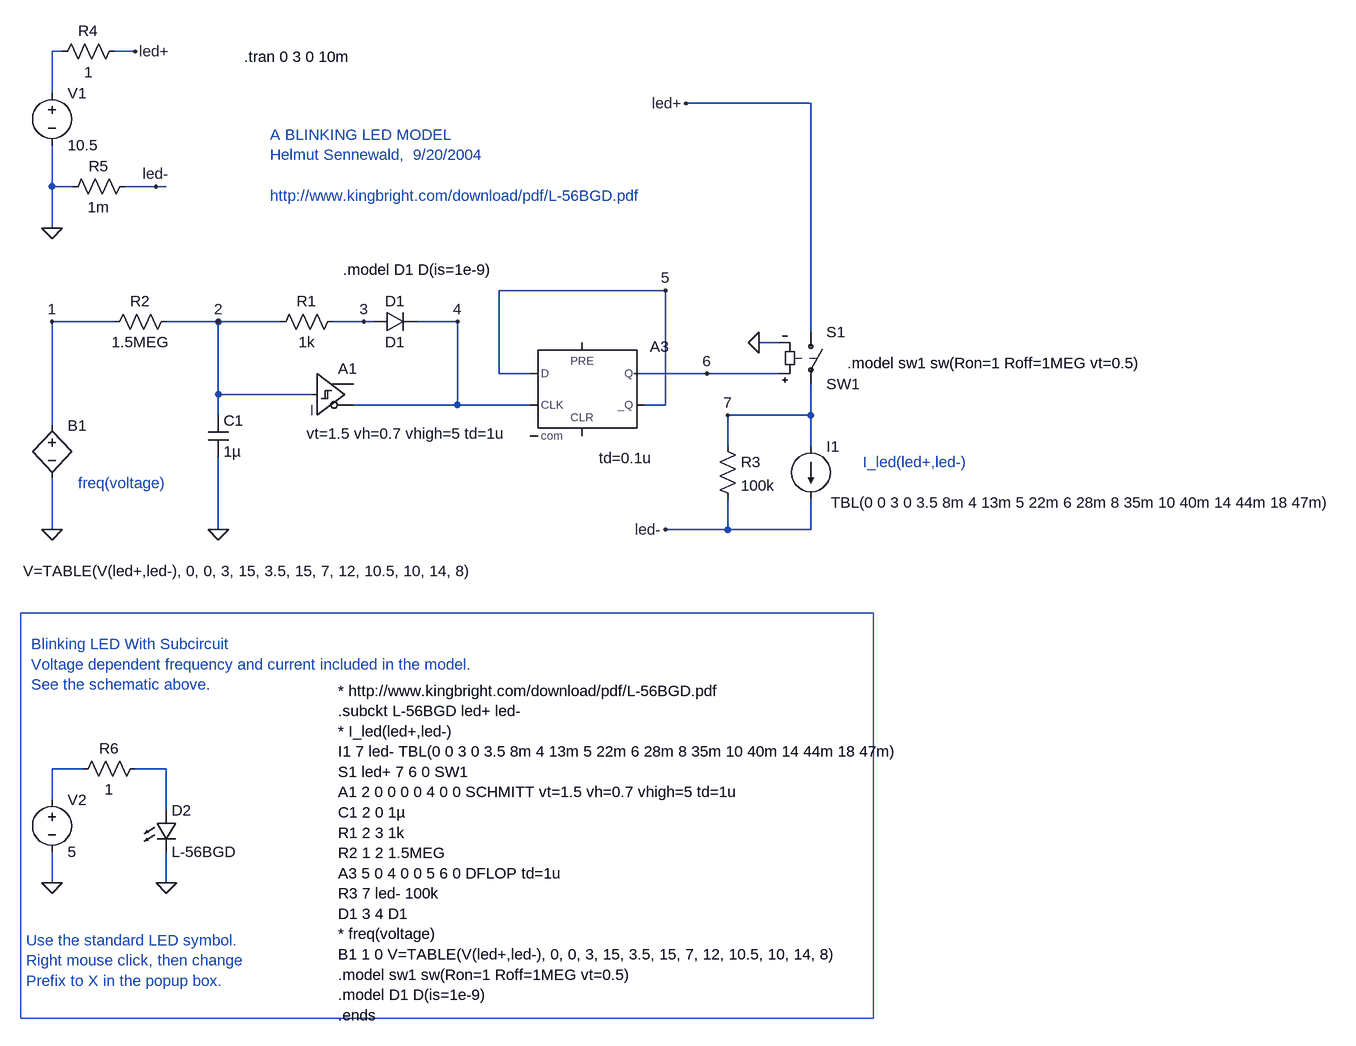
[diagram p0: schematic blinking_led.asc]
blinking_led.asc, the LTspice schematic file:
Version 4
SHEET 1 1328 1220
WIRE -336 224 -224 224
WIRE 208 192 208 240
WIRE 208 368 208 416
WIRE 160 128 128 128
WIRE 160 176 48 176
WIRE 208 112 208 -240
WIRE -560 208 -704 208
WIRE -704 208 -704 240
WIRE -704 304 -704 416
WIRE -496 224 -336 224
WIRE 208 240 80 240
WIRE 208 240 208 288
WIRE 208 -240 16 -240
WIRE -960 96 -864 96
WIRE -784 96 -704 96
WIRE -16 224 -16 48
WIRE -16 48 -272 48
WIRE -272 48 -272 176
WIRE -272 176 -224 176
WIRE -608 96 -704 96
WIRE -704 96 -704 208
WIRE -960 -256 -960 -320
WIRE -960 -176 -960 -112
WIRE 80 288 80 240
WIRE 80 368 80 416
WIRE -336 224 -336 96
WIRE -336 96 -400 96
WIRE -464 96 -480 96
WIRE -960 336 -960 416
WIRE -960 256 -960 96
WIRE -16 224 -48 224
WIRE 208 416 80 416
WIRE 80 416 -16 416
WIRE -960 -112 -928 -112
WIRE -960 -112 -960 -48
WIRE -784 -112 -800 -112
WIRE -960 -320 -944 -320
WIRE -800 -112 -848 -112
WIRE -480 96 -528 96
WIRE 48 176 -64 176
WIRE -784 912 -784 960
WIRE -784 848 -784 784
WIRE -784 784 -832 784
WIRE -960 832 -960 784
WIRE -960 912 -960 960
WIRE -864 -320 -832 -320
WIRE -912 784 -960 784
FLAG 128 128 0
FLAG -960 -48 0
FLAG -960 416 0
FLAG 16 -240 led+
FLAG -16 416 led-
FLAG -800 -112 led-
FLAG -832 -320 led+
FLAG -704 416 0
FLAG -960 96 1
FLAG -704 96 2
FLAG -480 96 3
FLAG -336 96 4
FLAG -16 48 5
FLAG 48 176 6
FLAG 80 240 7
FLAG -784 960 0
FLAG -960 960 0
SYMBOL load2 208 288 R0
WINDOW 3 31 86 Left 0
WINDOW 123 0 0 Left 0
WINDOW 39 0 0 Left 0
SYMATTR Value TBL(0 0 3 0 3.5 8m 4 13m 5 22m 6 28m 8 35m 10 40m 14 44m 18 47m)
SYMATTR InstName I1
SYMBOL sw 208 96 R0
SYMATTR InstName S1
SYMATTR Value SW1
SYMBOL Digital\\schmitt -560 144 R0
WINDOW 3 -8 124 Left 0
SYMATTR Value vt=1.5 vh=0.7 vhigh=5 td=1u
SYMATTR InstName A1
SYMBOL cap -720 240 R0
SYMATTR InstName C1
SYMATTR Value 1µ
SYMBOL res -624 112 R270
WINDOW 0 32 56 VTop 0
WINDOW 3 0 56 VBottom 0
SYMATTR InstName R1
SYMATTR Value 1k
SYMBOL res -880 112 R270
WINDOW 0 32 56 VTop 0
WINDOW 3 0 56 VBottom 0
SYMATTR InstName R2
SYMATTR Value 1.5MEG
SYMBOL Digital\\dflop -144 128 R0
WINDOW 3 26 178 Left 0
SYMATTR Value td=0.1u
SYMATTR InstName A3
SYMBOL voltage -960 -272 R0
SYMATTR InstName V1
SYMATTR Value 10.5
SYMBOL res 64 272 R0
SYMATTR InstName R3
SYMATTR Value 100k
SYMBOL diode -464 112 R270
WINDOW 0 32 32 VTop 0
WINDOW 3 0 32 VBottom 0
SYMATTR InstName D1
SYMATTR Value D1
SYMBOL bv -960 240 R0
WINDOW 3 -44 240 Left 0
SYMATTR Value V=TABLE(V(led+,led-), 0, 0, 3, 15, 3.5, 15, 7, 12, 10.5, 10, 14, 8)
SYMATTR InstName B1
SYMBOL res -944 -96 R270
WINDOW 0 32 56 VTop 0
WINDOW 3 0 56 VBottom 0
SYMATTR InstName R5
SYMATTR Value 1m
SYMBOL LED -800 848 R0
SYMATTR InstName D2
SYMATTR Value L-56BGD
SYMATTR Prefix X
SYMBOL voltage -960 816 R0
SYMATTR InstName V2
SYMATTR Value 5
SYMBOL res -960 -304 R270
WINDOW 0 32 56 VTop 0
WINDOW 3 0 56 VBottom 0
SYMATTR InstName R4
SYMATTR Value 1
SYMBOL res -928 800 R270
WINDOW 0 32 56 VTop 0
WINDOW 3 0 56 VBottom 0
SYMATTR InstName R6
SYMATTR Value 1
TEXT 264 160 Left 0 !.model sw1 sw(Ron=1 Roff=1MEG vt=0.5)
TEXT -664 -312 Left 0 !.tran 0 3 0 10m
TEXT -512 16 Left 0 !.model D1 D(is=1e-9)
TEXT -920 344 Left 0 ;freq(voltage)
TEXT 288 312 Left 0 ;I_led(led+,led-)
TEXT -520 664 Left 0 !* http://www.kingbright.com/download/pdf/L-56BGD.pdf\n.subckt L-56BGD led+ led-\n* I_led(led+,led-)\nI1 7 led- TBL(0 0 3 0 3.5 8m 4 13m 5 22m 6 28m 8 35m 10 40m 14 44m 18 47m)\nS1 led+ 7 6 0 SW1\nA1 2 0 0 0 0 4 0 0 SCHMITT vt=1.5 vh=0.7 vhigh=5 td=1u\nC1 2 0 1µ\nR1 2 3 1k\nR2 1 2 1.5MEG\nA3 5 0 4 0 0 5 6 0 DFLOP td=1u\nR3 7 led- 100k\nD1 3 4 D1\n* freq(voltage)\nB1 1 0 V=TABLE(V(led+,led-), 0, 0, 3, 15, 3.5, 15, 7, 12, 10.5, 10, 14, 8)\n.model sw1 sw(Ron=1 Roff=1MEG vt=0.5)\n.model D1 D(is=1e-9)\n.ends
TEXT -992 592 Left 0 ;Blinking LED With Subcircuit\nVoltage dependent frequency and current included in the model.\nSee the schematic above.
TEXT -624 -192 Left 0 ;A BLINKING LED MODEL\nHelmut Sennewald,  9/20/2004\n \nhttp://www.kingbright.com/download/pdf/L-56BGD.pdf
TEXT -1000 1048 Left 0 ;Use the standard LED symbol.\nRight mouse click, then change \nPrefix to X in the popup box.
RECTANGLE Normal 304 1168 -1008 544

The netlist it stands for:
* blinking_led.asc
I1 7 led- TBL(0 0 3 0 3.5 8m 4 13m 5 22m 6 28m 8 35m 10 40m 14 44m 18 47m)
S1 led+ 7 6 0 SW1
A1 2 0 0 0 0 4 0 0 SCHMITT vt=1.5 vh=0.7 vhigh=5 td=1u
C1 2 0 1µ
R1 2 3 1k
R2 1 2 1.5MEG
A3 5 0 4 0 0 5 6 0 DFLOP td=0.1u
V1 N001 0 10.5
R3 7 led- 100k
D1 3 4 D1
B1 1 0 V=TABLE(V(led+,led-), 0, 0, 3, 15, 3.5, 15, 7, 12, 10.5, 10, 14, 8)
R5 0 led- 1m
XD2 N002 0 L-56BGD  ; pins + -
V2 N003 0 5
R4 N001 led+ 1
R6 N003 N002 1
.model D D
.lib standard.dio
.model sw1 sw(Ron=1 Roff=1MEG vt=0.5)
.tran 0 3 0 10m
.model D1 D(is=1e-9)
* freq(voltage)
* I_led(led+,led-)
* http://www.kingbright.com/download/pdf/L-56BGD.pdf
.subckt L-56BGD led+ led-
* I_led(led+,led-)
I1 7 led- TBL(0 0 3 0 3.5 8m 4 13m 5 22m 6 28m 8 35m 10 40m 14 44m 18 47m)
S1 led+ 7 6 0 SW1
A1 2 0 0 0 0 4 0 0 SCHMITT vt=1.5 vh=0.7 vhigh=5 td=1u
C1 2 0 1µ
R1 2 3 1k
R2 1 2 1.5MEG
A3 5 0 4 0 0 5 6 0 DFLOP td=1u
R3 7 led- 100k
D1 3 4 D1
* freq(voltage)
B1 1 0 V=TABLE(V(led+,led-), 0, 0, 3, 15, 3.5, 15, 7, 12, 10.5, 10, 14, 8)
.model sw1 sw(Ron=1 Roff=1MEG vt=0.5)
.model D1 D(is=1e-9)
.ends
* Blinking LED With Subcircuit
* Voltage dependent frequency and current included in the model.
* See the schematic above.
* A BLINKING LED MODEL
* Helmut Sennewald,  9/20/2004
* http://www.kingbright.com/download/pdf/L-56BGD.pdf
* Use the standard LED symbol.
* Right mouse click, then change
* Prefix to X in the popup box.
.backanno
.end